# EAGLE schematic CFT-PB0-revF (EAGLE 5.11)
DRAWN_BY: Alexios; PROJECT_NAME: CFT Mini-Computer; REVISION: Rev B; SHEET_DESCRIPTION: Cover Sheet; SIMULATION_FILENAME: register.v#reg_L; URL: http://www.bedroomlan.org/cft

## Sheet 1 of 6
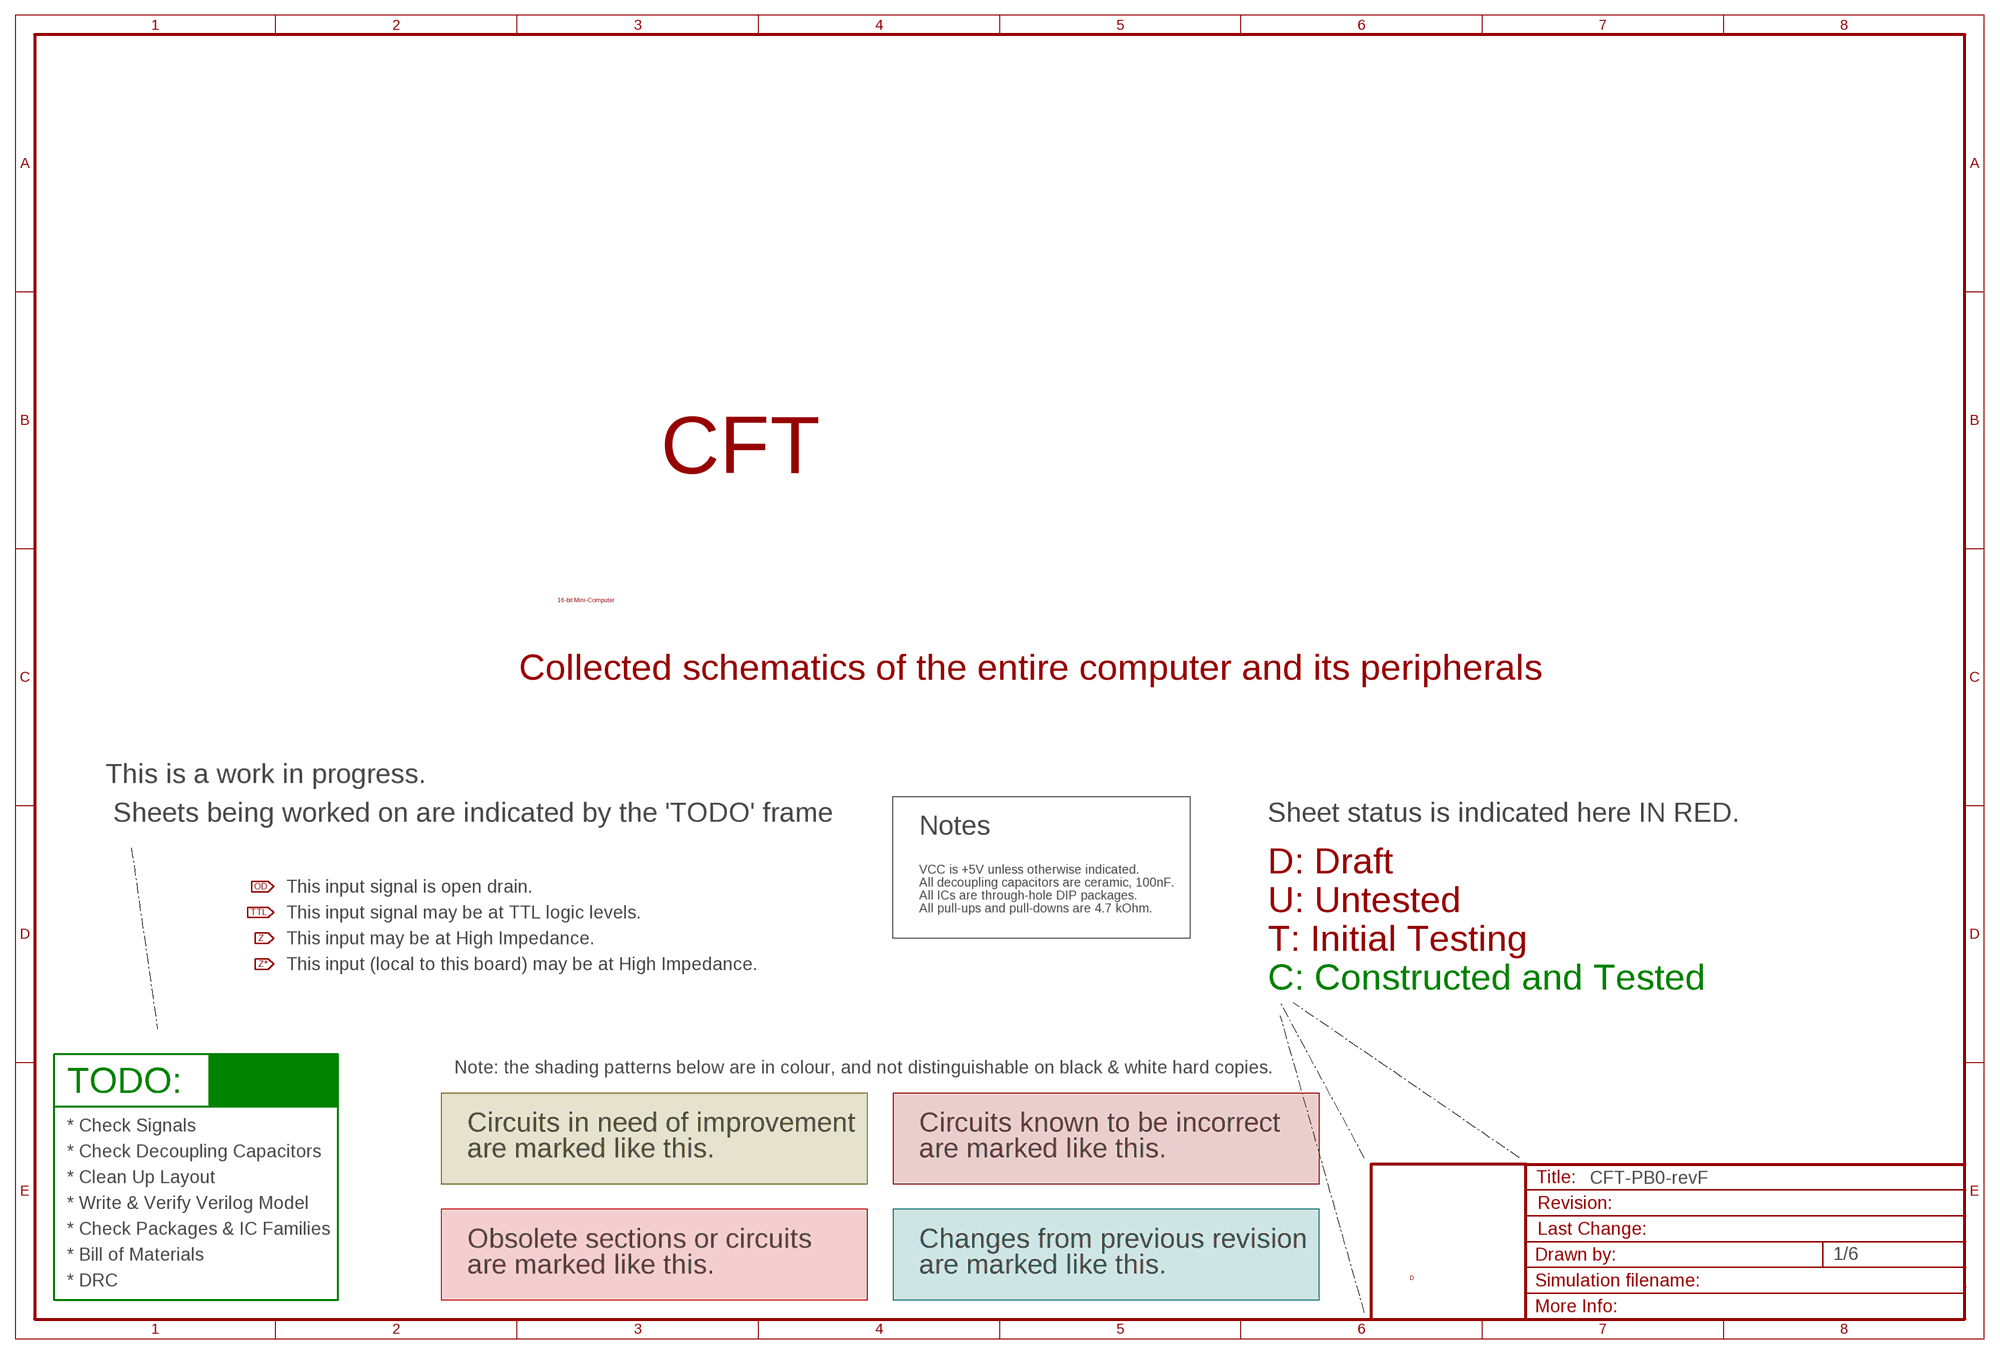
[diagram p0: schematic, sheet 1]

### Notes on the sheet
- CFT
- 16-bit Mini-Computer
- Collected schematics of the entire computer and its peripherals
- This is a work in progress.
- Sheets being worked on are indicated by the 'TODO' frame | Sheet status is indicated here IN RED.
- Notes
- VCC is +5V unless otherwise indicated. | D: Draft
- All decoupling capacitors are ceramic, 100nF.
- This input signal is open drain.
- All ICs are through-hole DIP packages.
- All pull-ups and pull-downs are 4.7 kOhm. | U: Untested
- This input signal may be at TTL logic levels.
- This input may be at High Impedance.
- T: Initial Testing
- This input (local to this board) may be at High Impedance.
- C: Constructed and Tested
- Note: the shading patterns below are in colour, and not distinguishable on black & white hard copies.
- TODO:
- * Check Signals | Circuits in need of improvement | Circuits known to be incorrect
- * Check Decoupling Capacitors | are marked like this. | are marked like this.
- * Clean Up Layout
- * Write & Verify Verilog Model
- * Check Packages & IC Families
- Obsolete sections or circuits | Changes from previous revision
- * Bill of Materials
- are marked like this. | are marked like this.
- D
- * DRC

## Sheet 2 of 6
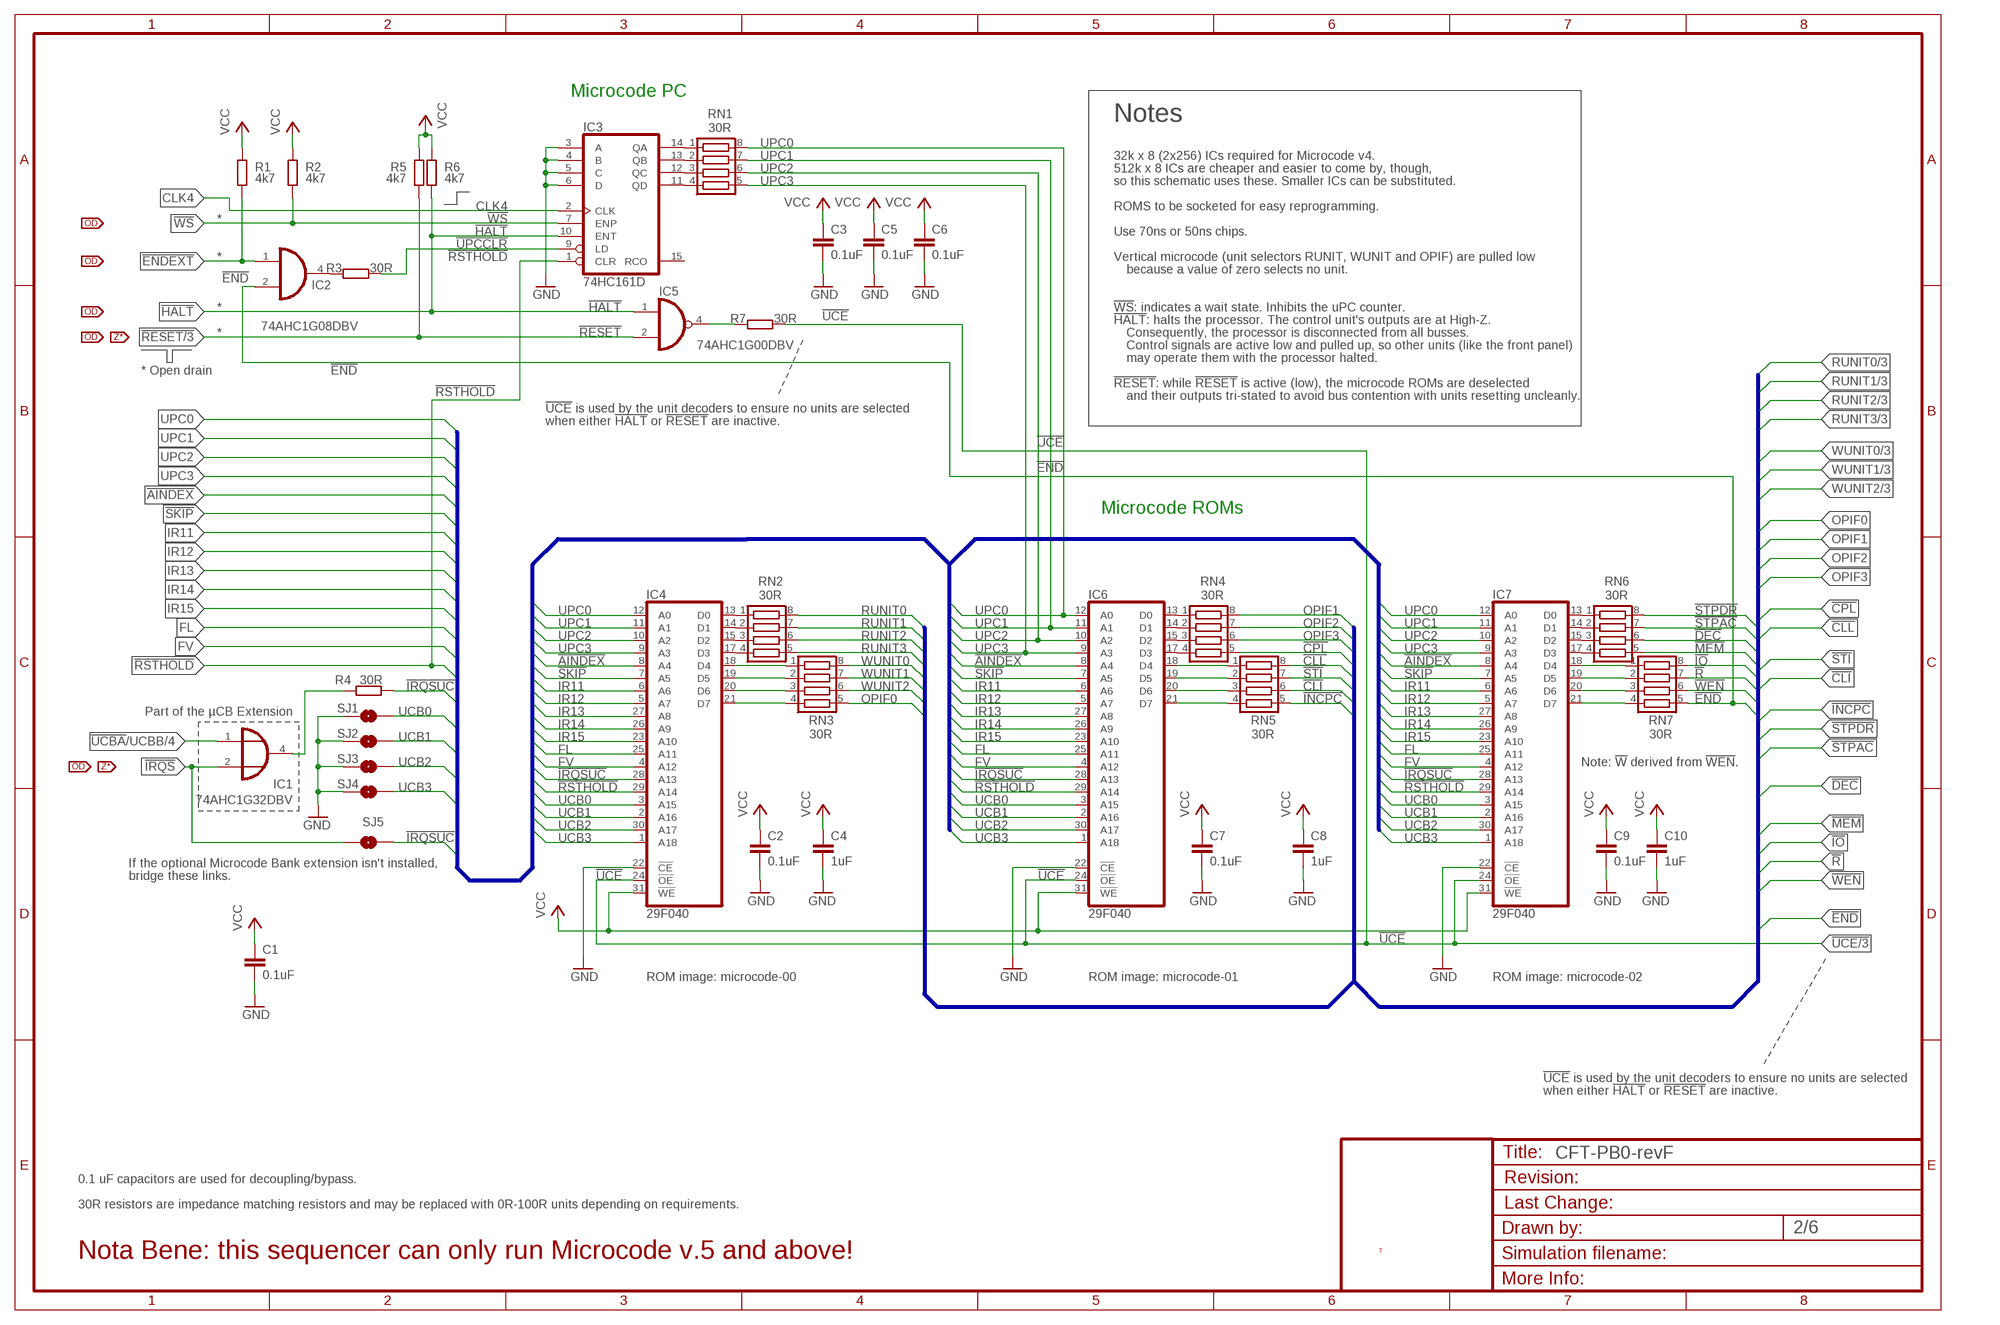
[diagram p1: schematic, sheet 2]

### Parts
C1  0.1uF  C-EUC0805K  [C0805K]
C2  0.1uF  C-EUC0805K  [C0805K]
C3  0.1uF  C-EUC0805K  [C0805K]
C4  1uF  C-EUC0805K  [C0805K]
C5  0.1uF  C-EUC0805K  [C0805K]
C6  0.1uF  C-EUC0805K  [C0805K]
C7  0.1uF  C-EUC0805K  [C0805K]
C8  1uF  C-EUC0805K  [C0805K]
C9  0.1uF  C-EUC0805K  [C0805K]
C10  1uF  C-EUC0805K  [C0805K]
IC1  74AHC1G32DBV  [SOT23-5]
IC2  74AHC1G08DBV  [SOT23-5]
IC3  74HC161D  [SO16D]
IC4  29F040  29F040PLCC32  [PLCC32]
IC5  74AHC1G00DBV  [SOT23-5]
IC6  29F040  29F040PLCC32  [PLCC32]
IC7  29F040  29F040PLCC32  [PLCC32]
R1  4k7  R-EU_R0805  [R0805]
R2  4k7  R-EU_R0805  [R0805]
R3  30R  R-EU_R0805  [R0805]
R4  30R  R-EU_R0805  [R0805]
R5  4k7  R-EU_R0805  [R0805]
R6  4k7  R-EU_R0805  [R0805]
R7  30R  R-EU_R0805  [R0805]
RN1  30R  CTS742C083  [CTS742C083]
RN2  30R  CTS742C083  [CTS742C083]
RN3  30R  CTS742C083  [CTS742C083]
RN4  30R  CTS742C083  [CTS742C083]
RN5  30R  CTS742C083  [CTS742C083]
RN6  30R  CTS742C083  [CTS742C083]
RN7  30R  CTS742C083  [CTS742C083]
SJ1  SOLDERJUMPER-OLDNO  [SJ_2S-NO]
SJ2  SOLDERJUMPER-OLDNO  [SJ_2S-NO]
SJ3  SOLDERJUMPER-OLDNO  [SJ_2S-NO]
SJ4  SOLDERJUMPER-OLDNO  [SJ_2S-NO]
SJ5  SOLDERJUMPER-OLDNO  [SJ_2S-NO]

### Nets
!AINDEX: IC4.8(A4) IC6.8(A4) IC7.8(A4) ; also sheet 5,6
!CLI: RN5.6 ; also sheet 5,6
!CLL: RN5.8 ; also sheet 5,6
!CPL: RN4.5 ; also sheet 5,6
!DEC: RN6.6 ; also sheet 5,6
!END: IC2.2(I1) RN7.5 ; also sheet 4,5,6
!ENDEXT: IC2.1(I0) R1.1 ; also sheet 6
!HALT: IC3.10(ENT) IC5.1(I0) R6.1 ; also sheet 6
!INCPC: RN5.5 ; also sheet 5,6
!IO: RN7.8 ; also sheet 5,6
!IRQS: IC1.2(I1) SJ5.2 ; also sheet 6
!IRQSUC: IC4.28(A13) IC6.28(A13) IC7.28(A13) R4.2 SJ5.1 ; also sheet 5
!MEM: RN6.5 ; also sheet 5,6
!R: RN7.7 ; also sheet 5,6
!RESET: IC5.2(I1) R5.1 ; also sheet 3,4,6
!RSTHOLD: IC3.1(CLR) IC4.29(A14) IC6.29(A14) IC7.29(A14) ; also sheet 5,6
!SKIP: IC4.7(A5) IC6.7(A5) IC7.7(A5) ; also sheet 5,6
!STI: RN5.7 ; also sheet 5,6
!STPAC: RN6.7 ; also sheet 5,6
!STPDR: RN6.8 ; also sheet 5,6
!UCBA!/UCBB: IC1.1(I0) ; also sheet 4
!UCE: IC4.24(!OE) IC6.24(!OE) IC7.24(!OE) R7.2 ; also sheet 3
!UPCCLR: IC3.9(LD) R3.2
!WEN: RN7.6 ; also sheet 5,6
!WS: IC3.7(ENP) R2.1 ; also sheet 6
CLK4: IC3.2(CLK) ; also sheet 5,6
FL: IC4.25(A11) IC6.25(A11) IC7.25(A11) ; also sheet 5,6
FV: IC4.4(A12) IC6.4(A12) IC7.4(A12) ; also sheet 5,6
GND [power rail]: C1.2 C2.2 C3.2 C4.2 C5.2 C6.2 C7.2 C8.2 C9.2 C10.2 IC3.3(A) IC3.4(B) IC3.5(C) IC3.6(D) IC4.22(!CE) IC6.22(!CE) IC7.22(!CE) SJ1.1 SJ2.1 SJ3.1 SJ4.1 ; also sheet 3,4,5,6
IR11: IC4.6(A6) IC6.6(A6) IC7.6(A6) ; also sheet 5,6
IR12: IC4.5(A7) IC6.5(A7) IC7.5(A7) ; also sheet 5,6
IR13: IC4.27(A8) IC6.27(A8) IC7.27(A8) ; also sheet 5,6
IR14: IC4.26(A9) IC6.26(A9) IC7.26(A9) ; also sheet 5,6
IR15: IC4.23(A10) IC6.23(A10) IC7.23(A10) ; also sheet 5,6
N$45: IC5.4(O) R7.1
N$47: IC1.4(O) R4.1
N$54: IC4.14(D1) RN2.2
N$56: IC6.14(D1) RN4.2
N$57: IC6.15(D2) RN4.3
N$58: IC6.17(D3) RN4.4
N$59: IC6.13(D0) RN4.1
N$60: IC6.19(D5) RN5.2
N$61: IC7.14(D1) RN6.2
N$62: IC7.15(D2) RN6.3
N$63: IC7.17(D3) RN6.4
N$64: IC7.13(D0) RN6.1
N$65: IC7.19(D5) RN7.2
N$66: IC7.20(D6) RN7.3
N$67: IC7.21(D7) RN7.4
N$68: IC7.18(D4) RN7.1
N$69: IC6.20(D6) RN5.3
N$70: IC6.21(D7) RN5.4
N$71: IC6.18(D4) RN5.1
N$72: IC3.13(QB) RN1.2
N$73: IC3.12(QC) RN1.3
N$74: IC3.11(QD) RN1.4
N$75: IC3.14(QA) RN1.1
N$90: IC2.4(O) R3.1
N$93: IC4.15(D2) RN2.3
N$94: IC4.17(D3) RN2.4
N$95: IC4.13(D0) RN2.1
N$96: IC4.19(D5) RN3.2
N$97: IC4.20(D6) RN3.3
N$98: IC4.21(D7) RN3.4
N$99: IC4.18(D4) RN3.1
OPIF0: RN3.5 ; also sheet 5,6
OPIF1: RN4.8 ; also sheet 5,6
OPIF2: RN4.7 ; also sheet 5,6
OPIF3: RN4.6 ; also sheet 5,6
RUNIT0: RN2.8 ; also sheet 3,5,6
RUNIT1: RN2.7 ; also sheet 3,5,6
RUNIT2: RN2.6 ; also sheet 3,5,6
RUNIT3: RN2.5 ; also sheet 3,5,6
UCB0: IC4.3(A15) IC6.3(A15) IC7.3(A15) SJ1.2 ; also sheet 4,5
UCB1: IC4.2(A16) IC6.2(A16) IC7.2(A16) SJ2.2 ; also sheet 4,5
UCB2: IC4.30(A17) IC6.30(A17) IC7.30(A17) SJ3.2 ; also sheet 4,5
UCB3: IC4.1(A18) IC6.1(A18) IC7.1(A18) SJ4.2 ; also sheet 4,5
UPC0: IC4.12(A0) IC6.12(A0) IC7.12(A0) RN1.8 ; also sheet 5
UPC1: IC4.11(A1) IC6.11(A1) IC7.11(A1) RN1.7 ; also sheet 5
UPC2: IC4.10(A2) IC6.10(A2) IC7.10(A2) RN1.6 ; also sheet 5
UPC3: IC4.9(A3) IC6.9(A3) IC7.9(A3) RN1.5 ; also sheet 5
VCC [power rail]: C1.1 C2.1 C3.1 C4.1 C5.1 C6.1 C7.1 C8.1 C9.1 C10.1 IC4.31(!WE) IC6.31(!WE) IC7.31(!WE) R1.2 R2.2 R5.2 R6.2 ; also sheet 3,4,5,6
WUNIT0: RN3.8 ; also sheet 3,5
WUNIT1: RN3.7 ; also sheet 3,5
WUNIT2: RN3.6 ; also sheet 3,5
Unconnected: IC3.15(RCO)

### Buses
MCINSTR:RUNIT[0..3],WUNIT[0..2],OPIF[0..3],!CPL,!CLL,!STI,!CLI,!INCPC,!STPDR,!STPAC,!DEC,!MEM,!IO,!R,!WEN,!END
MCADDR:UPC[0..3],!AINDEX,!SKIP,IR[11..15],FL,FV,!IRQSUC,!RSTHOLD,UCB[0..3]

### Notes on the sheet
- Microcode PC
- Notes
- 32k x 8 (2x256) ICs required for Microcode v4.
- 512k x 8 ICs are cheaper and easier to come by, though,
- so this schematic uses these. Smaller ICs can be substituted.
- ROMS to be socketed for easy reprogramming.
- *
- Use 70ns or 50ns chips.
- * | Vertical microcode (unit selectors RUNIT, WUNIT and OPIF) are pulled low
- because a value of zero selects no unit.
- * | !WS!: indicates a wait state. Inhibits the uPC counter.
- !HALT!: halts the processor. The control unit's outputs are at High-Z.
- * | Consequently, the processor is disconnected from all busses.
- Control signals are active low and pulled up, so other units (like the front panel)
- may operate them with the processor halted.
- * Open drain
- !RESET!: while !RESET! is active (low), the microcode ROMs are deselected
- and their outputs tri-stated to avoid bus contention with units resetting uncleanly.
- !UCE! is used by the unit decoders to ensure no units are selected
- when either !HALT! or !RESET! are inactive.
- Microcode ROMs
- Part of the µCB Extension
- Note: !W! derived from !WEN!.
- If the optional Microcode Bank extension isn't installed,
- bridge these links.
- ROM image: microcode-00 | ROM image: microcode-01 | ROM image: microcode-02
- !UCE! is used by the unit decoders to ensure no units are selected
- when either !HALT! or !RESET! are inactive.
- 0.1 uF capacitors are used for decoupling/bypass.
- 30R resistors are impedance matching resistors and may be replaced with 0R-100R units depending on requirements.
- T
- Nota Bene: this sequencer can only run Microcode v.5 and above!

## Sheet 3 of 6
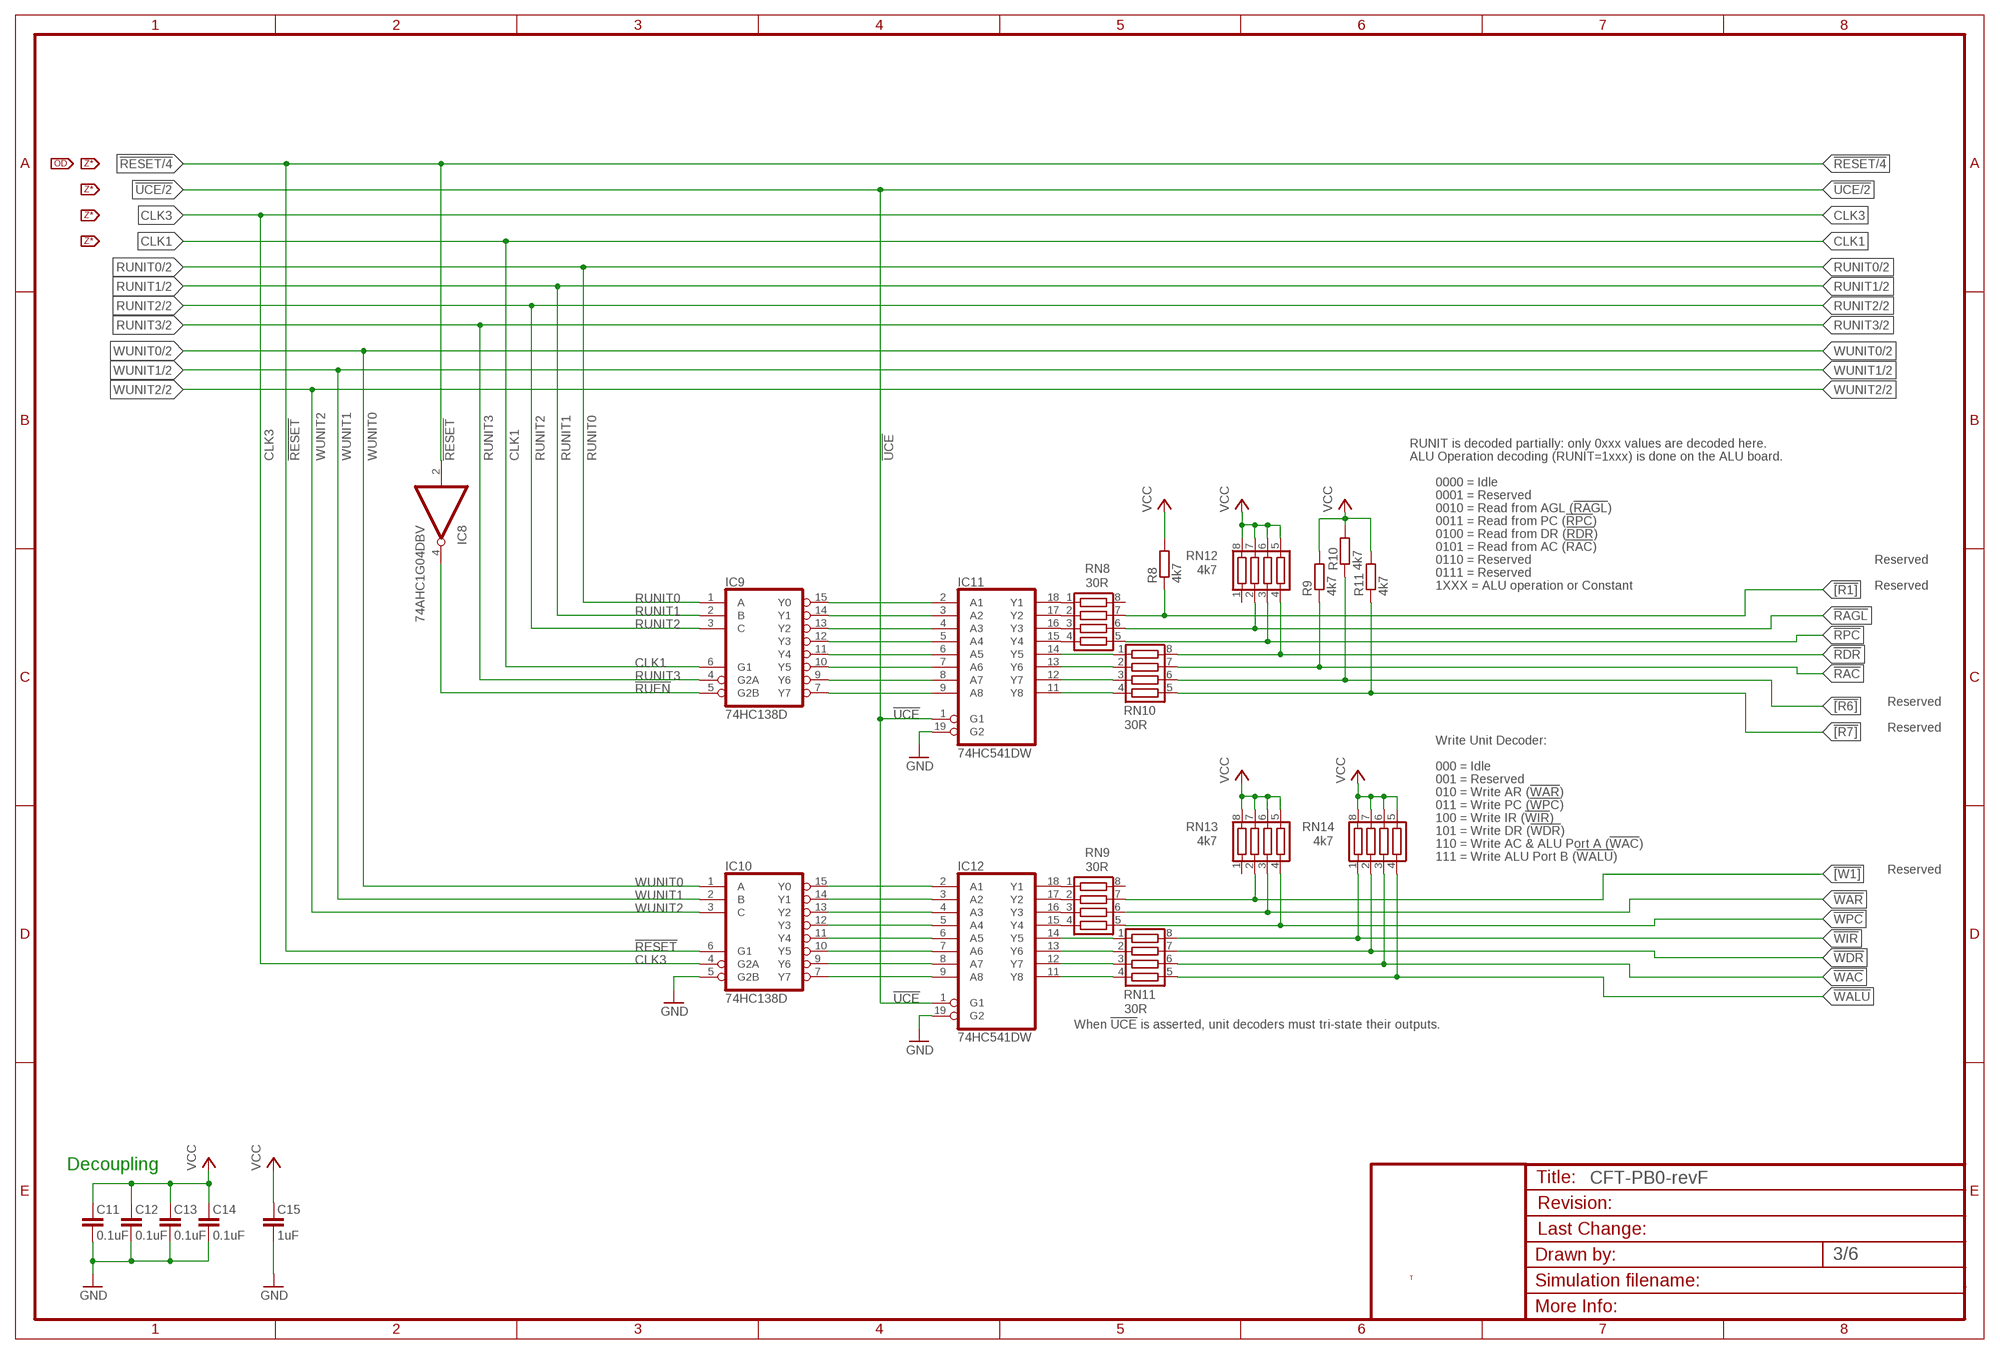
[diagram p2: schematic, sheet 3]

### Parts
C11  0.1uF  C-EUC0805K  [C0805K]
C12  0.1uF  C-EUC0805K  [C0805K]
C13  0.1uF  C-EUC0805K  [C0805K]
C14  0.1uF  C-EUC0805K  [C0805K]
C15  1uF  C-EUC0805K  [C0805K]
IC8  74AHC1G04DBV  [SOT23-5]
IC9  74HC138D  [SO16]
IC10  74HC138D  [SO16]
IC11  74HC541DW  [SO20W]
IC12  74HC541DW  [SO20W]
R8  4k7  R-EU_R0805  [R0805]
R9  4k7  R-EU_R0805  [R0805]
R10  4k7  R-EU_R0805  [R0805]
R11  4k7  R-EU_R0805  [R0805]
RN8  30R  CTS742C083  [CTS742C083]
RN9  30R  CTS742C083  [CTS742C083]
RN10  30R  CTS742C083  [CTS742C083]
RN11  30R  CTS742C083  [CTS742C083]
RN12  4k7  CTS742C083  [CTS742C083]
RN13  4k7  CTS742C083  [CTS742C083]
RN14  4k7  CTS742C083  [CTS742C083]

### Nets
![R1]: R8.1 RN8.7 ; also sheet 6
![R6]: R10.1 RN10.6 ; also sheet 6
![R7]: R11.1 RN10.5 ; also sheet 6
![W1]: RN9.7 RN13.2 ; also sheet 6
!RAC: R9.1 RN10.7 ; also sheet 6
!RAGL: RN8.6 RN12.2 ; also sheet 6
!RDR: RN10.8 RN12.4 ; also sheet 6
!RESET: IC8.2(I) IC10.6(G1) ; also sheet 2,4,6
!RPC: RN8.5 RN12.3 ; also sheet 6
!RUEN: IC8.4(O) IC9.5(G2B)
!UCE: IC11.1(G1) IC12.1(G1) ; also sheet 2
!WAC: RN11.6 RN14.3 ; also sheet 6
!WALU: RN11.5 RN14.4 ; also sheet 6
!WAR: RN9.6 RN13.3 ; also sheet 6
!WDR: RN11.7 RN14.2 ; also sheet 6
!WIR: RN11.8 RN14.1 ; also sheet 6
!WPC: RN9.5 RN13.4 ; also sheet 6
CLK1: IC9.6(G1) ; also sheet 5,6
CLK3: IC10.4(G2A) ; also sheet 5,6
GND [power rail]: C11.1 C12.1 C13.1 C14.1 C15.1 IC10.5(G2B) IC11.19(G2) IC12.19(G2) ; also sheet 2,4,5,6
N$46: IC11.17(Y2) RN8.2
N$49: IC11.16(Y3) RN8.3
N$50: IC11.15(Y4) RN8.4
N$51: IC11.18(Y1) RN8.1
N$52: IC11.13(Y6) RN10.2
N$53: IC11.12(Y7) RN10.3
N$55: IC12.17(Y2) RN9.2
N$76: IC12.16(Y3) RN9.3
N$77: IC12.15(Y4) RN9.4
N$78: IC12.18(Y1) RN9.1
N$79: IC12.13(Y6) RN11.2
N$80: IC12.12(Y7) RN11.3
N$81: IC12.11(Y8) RN11.4
N$82: IC11.11(Y8) RN10.4
N$87: IC11.14(Y5) RN10.1
N$92: IC12.14(Y5) RN11.1
N$458: IC9.7(Y7) IC11.9(A8)
N$459: IC9.9(Y6) IC11.8(A7)
N$460: IC9.10(Y5) IC11.7(A6)
N$461: IC9.11(Y4) IC11.6(A5)
N$463: IC9.12(Y3) IC11.5(A4)
N$464: IC9.13(Y2) IC11.4(A3)
N$465: IC9.14(Y1) IC11.3(A2)
N$466: IC9.15(Y0) IC11.2(A1)
N$483: IC10.15(Y0) IC12.2(A1)
N$484: IC10.14(Y1) IC12.3(A2)
N$485: IC10.13(Y2) IC12.4(A3)
N$486: IC10.12(Y3) IC12.5(A4)
N$487: IC10.11(Y4) IC12.6(A5)
N$488: IC10.10(Y5) IC12.7(A6)
N$505: IC10.9(Y6) IC12.8(A7)
N$506: IC10.7(Y7) IC12.9(A8)
RUNIT0: IC9.1(A) ; also sheet 2,5,6
RUNIT1: IC9.2(B) ; also sheet 2,5,6
RUNIT2: IC9.3(C) ; also sheet 2,5,6
RUNIT3: IC9.4(G2A) ; also sheet 2,5,6
VCC [power rail]: C11.2 C12.2 C13.2 C14.2 C15.2 R8.2 R9.2 R10.2 R11.2 RN12.5 RN12.6 RN12.7 RN12.8 RN13.5 RN13.6 RN13.7 RN13.8 RN14.5 RN14.6 RN14.7 RN14.8 ; also sheet 2,4,5,6
WUNIT0: IC10.1(A) ; also sheet 2,5
WUNIT1: IC10.2(B) ; also sheet 2,5
WUNIT2: IC10.3(C) ; also sheet 2,5
Unconnected: RN8.8 RN9.8 RN12.1 RN13.1

### Notes on the sheet
- RUNIT is decoded partially: only 0xxx values are decoded here.
- ALU Operation decoding (RUNIT=1xxx) is done on the ALU board.
- 0000 = Idle
- 0001 = Reserved
- 0010 = Read from AGL (!RAGL!)
- 0011 = Read from PC (!RPC!)
- 0100 = Read from DR (!RDR!)
- 0101 = Read from AC (!RAC!)
- 0110 = Reserved | Reserved
- 0111 = Reserved
- 1XXX = ALU operation or Constant | Reserved
- Reserved
- Reserved
- Write Unit Decoder:
- 000 = Idle
- 001 = Reserved
- 010 = Write AR (!WAR!)
- 011 = Write PC (!WPC!)
- 100 = Write IR (!WIR!)
- 101 = Write DR (!WDR!)
- 110 = Write AC & ALU Port A (!WAC!)
- 111 = Write ALU Port B (!WALU!)
- Reserved
- When !UCE! is asserted, unit decoders must tri-state their outputs.
- Decoupling
- T

## Sheet 4 of 6
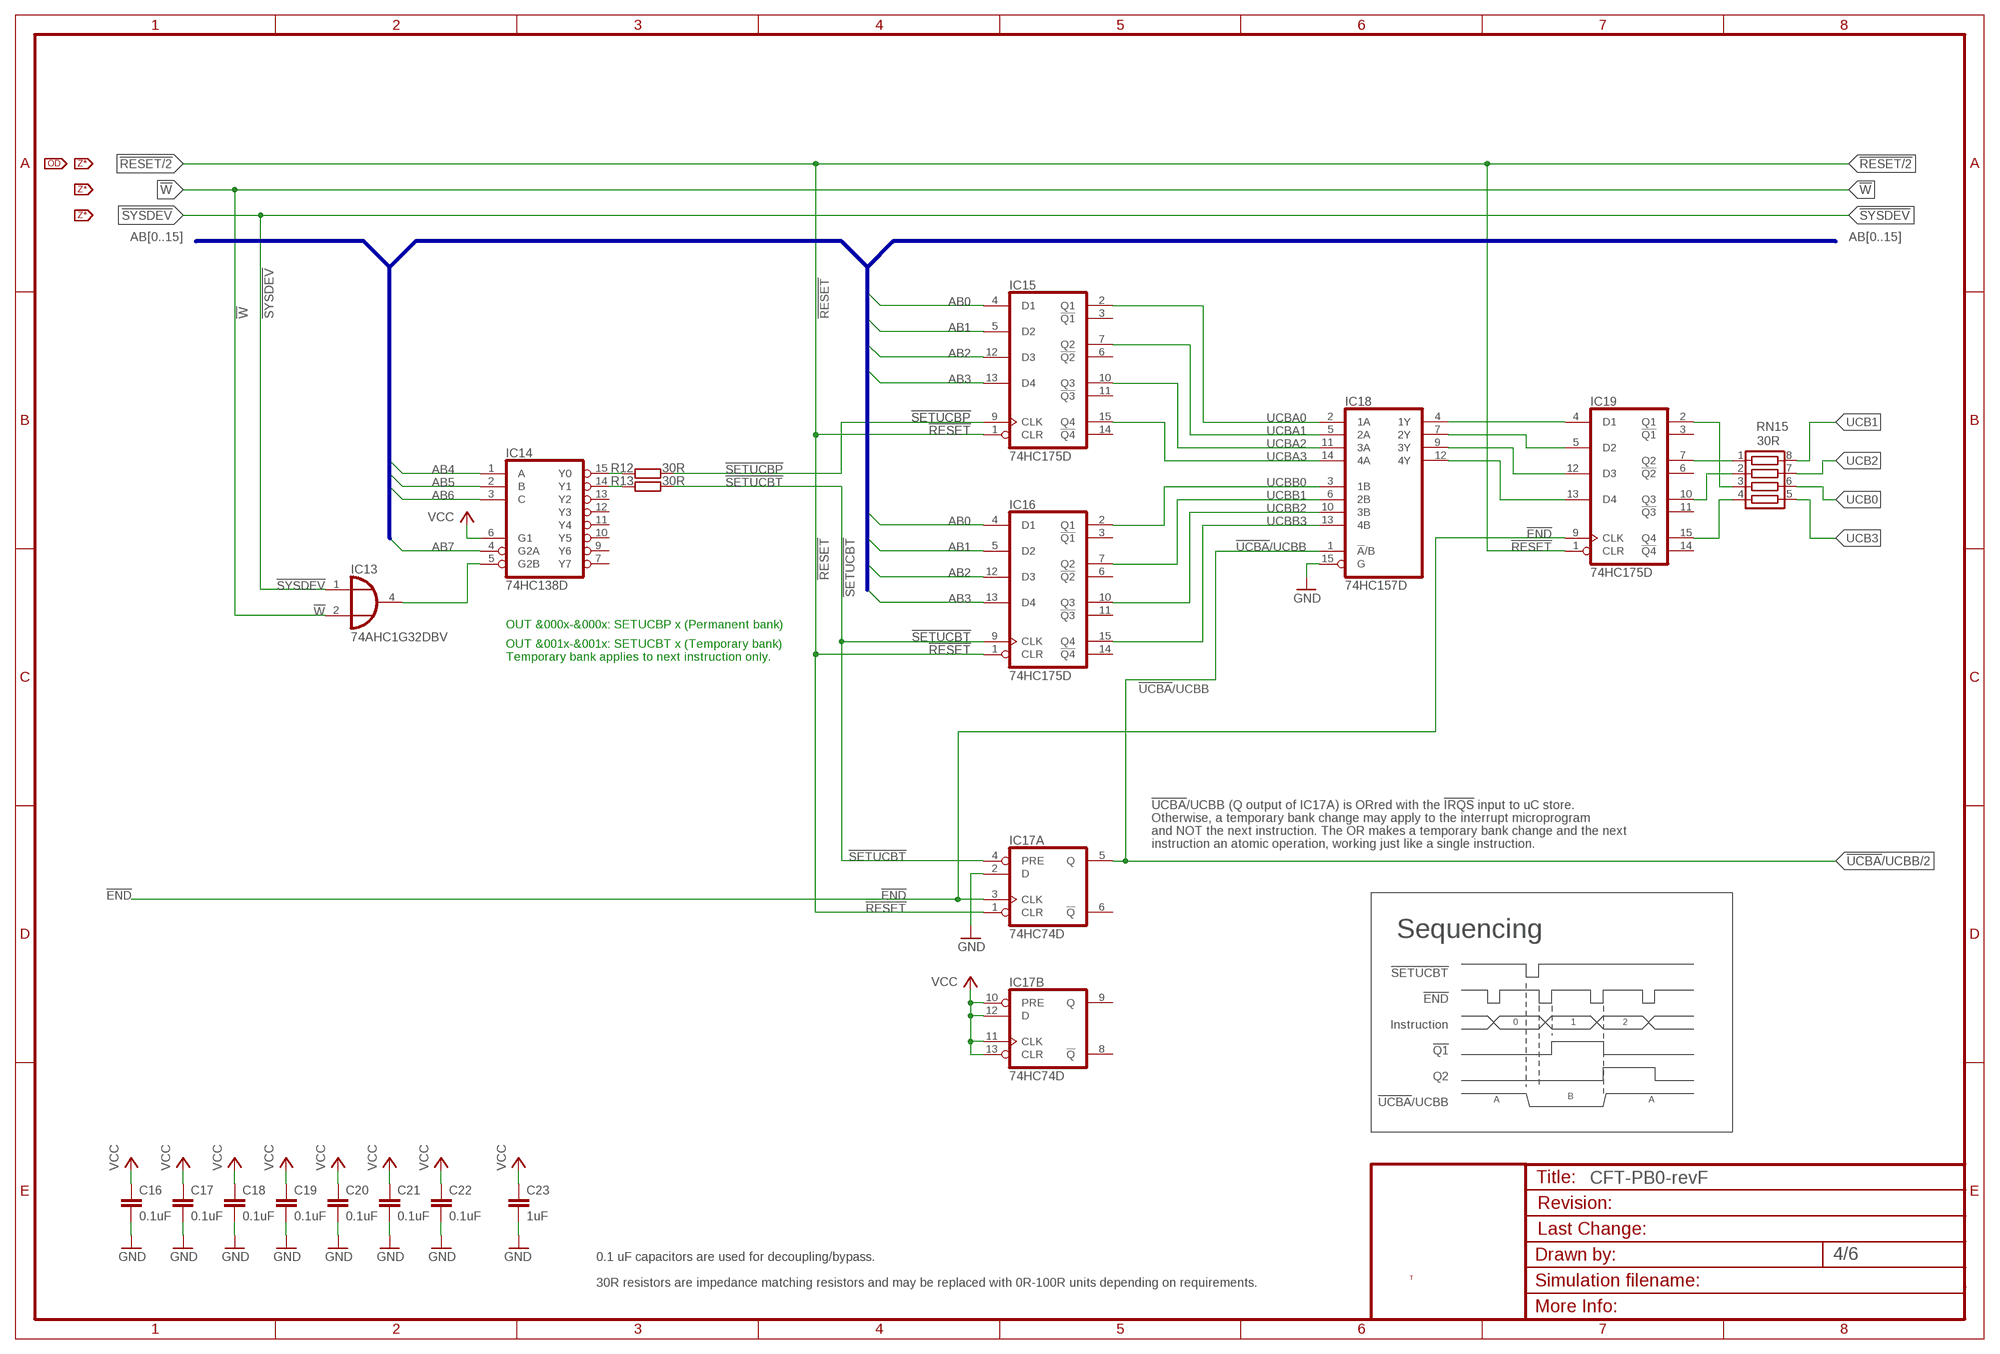
[diagram p3: schematic, sheet 4]

### Parts
C16  0.1uF  C-EUC0805K  [C0805K]
C17  0.1uF  C-EUC0805K  [C0805K]
C18  0.1uF  C-EUC0805K  [C0805K]
C19  0.1uF  C-EUC0805K  [C0805K]
C20  0.1uF  C-EUC0805K  [C0805K]
C21  0.1uF  C-EUC0805K  [C0805K]
C22  0.1uF  C-EUC0805K  [C0805K]
C23  1uF  C-EUC0805K  [C0805K]
IC13  74AHC1G32DBV  [SOT23-5]
IC14  74HC138D  [SO16]
IC15  74HC175D  [SO16]
IC16  74HC175D  [SO16]
IC17  74HC74D  [SO14]
IC18  74HC157D  74HC157/ALT-D  [SO16]
IC19  74HC175D  [SO16]
R12  30R  R-EU_R0805  [R0805]
R13  30R  R-EU_R0805  [R0805]
RN15  30R  CTS742C083  [CTS742C083]

### Nets
!END: IC17.3(A:CLK) IC19.9(CLK) ; also sheet 2,5,6
!RESET: IC15.1(CLR) IC16.1(CLR) IC17.1(A:CLR) IC19.1(CLR) ; also sheet 2,3,6
!SETUCBP: IC15.9(CLK) R12.2
!SETUCBT: IC16.9(CLK) IC17.4(A:PRE) R13.2
!SYSDEV: IC13.1(I0) ; also sheet 5,6
!UCBA!/UCBB: IC17.5(A:Q) IC18.1(!A!/B) ; also sheet 2
!W: IC13.2(I1) ; also sheet 5,6
AB0: IC15.4(D1) IC16.4(D1) ; also sheet 5,6
AB1: IC15.5(D2) IC16.5(D2) ; also sheet 5,6
AB2: IC15.12(D3) IC16.12(D3) ; also sheet 5,6
AB3: IC15.13(D4) IC16.13(D4) ; also sheet 5,6
AB4: IC14.1(A) ; also sheet 5,6
AB5: IC14.2(B) ; also sheet 5,6
AB6: IC14.3(C) ; also sheet 5,6
AB7: IC14.4(G2A) ; also sheet 5,6
GND [power rail]: C16.2 C17.2 C18.2 C19.2 C20.2 C21.2 C22.2 C23.2 IC17.2(A:D) IC18.15(G) ; also sheet 2,3,5,6
N$1: IC13.4(O) IC14.5(G2B)
N$2: IC18.4(1Y) IC19.4(D1)
N$3: IC18.7(2Y) IC19.5(D2)
N$4: IC18.9(3Y) IC19.12(D3)
N$5: IC18.12(4Y) IC19.13(D4)
N$48: IC19.10(Q3) RN15.2
N$83: IC14.15(Y0) R12.1
N$84: IC14.14(Y1) R13.1
N$88: IC19.2(Q1) RN15.3
N$89: IC19.7(Q2) RN15.1
N$91: IC19.15(Q4) RN15.4
UCB0: RN15.6 ; also sheet 2,5
UCB1: RN15.8 ; also sheet 2,5
UCB2: RN15.7 ; also sheet 2,5
UCB3: RN15.5 ; also sheet 2,5
UCBA0: IC15.2(Q1) IC18.2(1A)
UCBA1: IC15.7(Q2) IC18.5(2A)
UCBA2: IC15.10(Q3) IC18.11(3A)
UCBA3: IC15.15(Q4) IC18.14(4A)
UCBB0: IC16.2(Q1) IC18.3(1B)
UCBB1: IC16.7(Q2) IC18.6(2B)
UCBB2: IC16.10(Q3) IC18.10(3B)
UCBB3: IC16.15(Q4) IC18.13(4B)
VCC [power rail]: C16.1 C17.1 C18.1 C19.1 C20.1 C21.1 C22.1 C23.1 IC14.6(G1) IC17.10(B:PRE) IC17.11(B:CLK) IC17.12(B:D) IC17.13(B:CLR) ; also sheet 2,3,5,6
Unconnected: IC14.7(Y7) IC14.9(Y6) IC14.10(Y5) IC14.11(Y4) IC14.12(Y3) IC14.13(Y2) IC15.3(!Q1) IC15.6(!Q2) IC15.11(!Q3) IC15.14(!Q4) IC16.3(!Q1) IC16.6(!Q2) IC16.11(!Q3) IC16.14(!Q4) IC17.6(A:!Q) IC17.8(B:!Q) IC17.9(B:Q) IC19.3(!Q1) IC19.6(!Q2) IC19.11(!Q3) IC19.14(!Q4)

### Buses
AB[0..15]

### Notes on the sheet
- OUT &000x-&000x: SETUCBP x (Permanent bank)
- OUT &001x-&001x: SETUCBT x (Temporary bank)
- Temporary bank applies to next instruction only.
- !UCBA!/UCBB (Q output of IC17A) is ORred with the !IRQS! input to uC store.
- Otherwise, a temporary bank change may apply to the interrupt microprogram
- and NOT the next instruction. The OR makes a temporary bank change and the next
- instruction an atomic operation, working just like a single instruction.
- Sequencing
- !SETUCBT
- !END
- 0 | 1 | 2
- Instruction
- !Q1
- Q2
- B
- A | A
- !UCBA!/UCBB
- 0.1 uF capacitors are used for decoupling/bypass.
- T
- 30R resistors are impedance matching resistors and may be replaced with 0R-100R units depending on requirements.

## Sheet 5 of 6
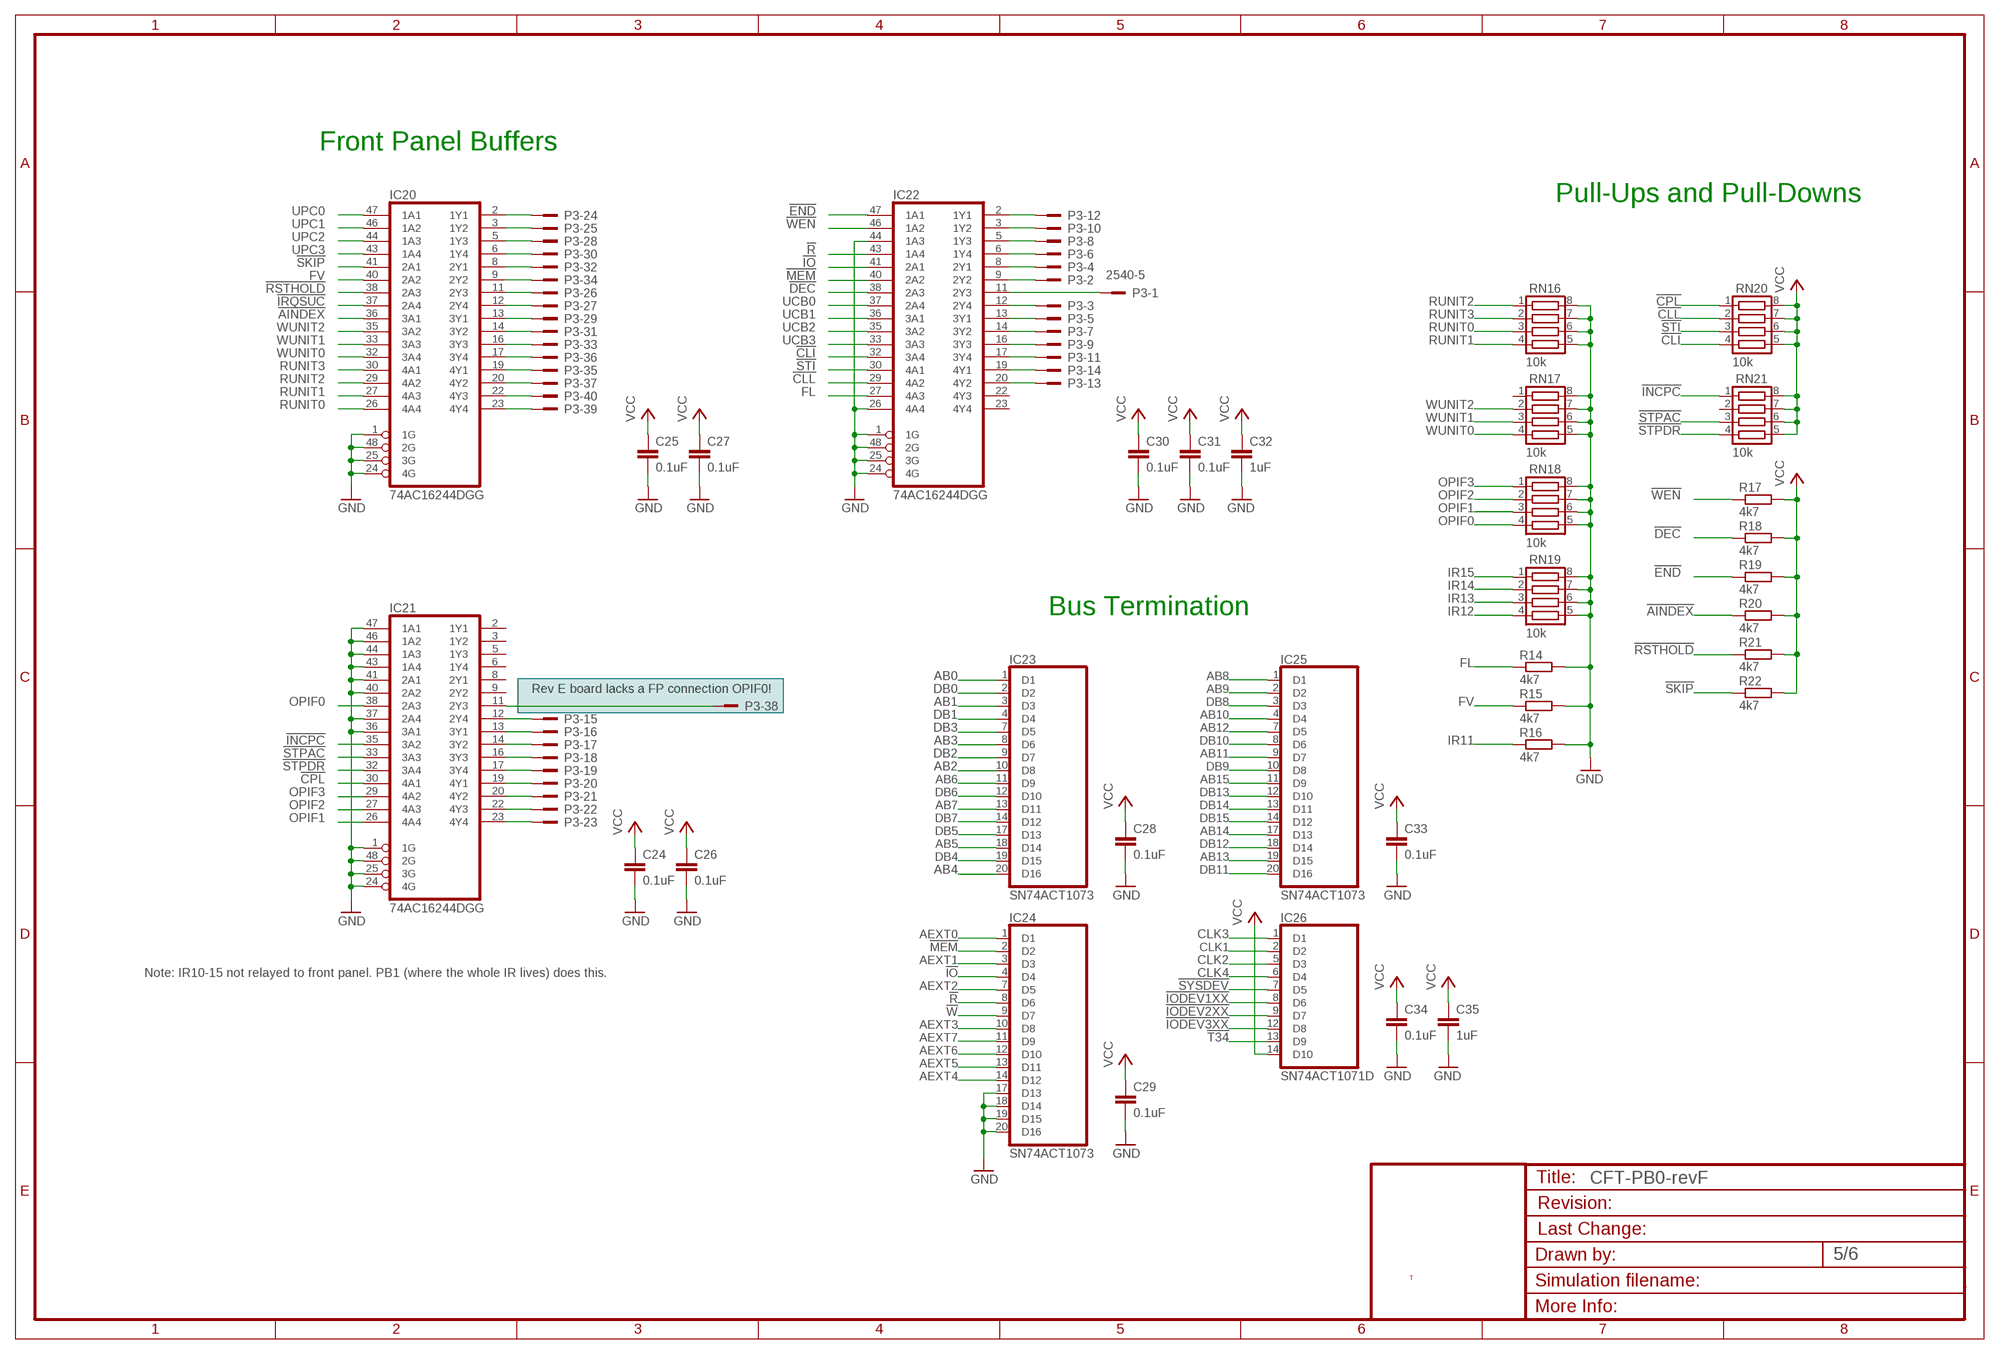
[diagram p4: schematic, sheet 5]

### Parts
C24  0.1uF  C-EUC0805K  [C0805K]
C25  0.1uF  C-EUC0805K  [C0805K]
C26  0.1uF  C-EUC0805K  [C0805K]
C27  0.1uF  C-EUC0805K  [C0805K]
C28  0.1uF  C-EUC0805K  [C0805K]
C29  0.1uF  C-EUC0805K  [C0805K]
C30  0.1uF  C-EUC0805K  [C0805K]
C31  0.1uF  C-EUC0805K  [C0805K]
C32  1uF  C-EUC0805K  [C0805K]
C33  0.1uF  C-EUC0805K  [C0805K]
C34  0.1uF  C-EUC0805K  [C0805K]
C35  1uF  C-EUC0805K  [C0805K]
IC20  74AC16244DGG  [TSSOP-48]
IC21  74AC16244DGG  [TSSOP-48]
IC22  74AC16244DGG  [TSSOP-48]
IC23  SN74ACT1073  [SO20W]
IC24  SN74ACT1073  [SO20W]
IC25  SN74ACT1073  [SO20W]
IC26  SN74ACT1071D  [SO14]
P3  2540-5  [PAK100/2500-5-40]
R14  4k7  R-EU_R0805  [R0805]
R15  4k7  R-EU_R0805  [R0805]
R16  4k7  R-EU_R0805  [R0805]
R17  4k7  R-EU_R0805  [R0805]
R18  4k7  R-EU_R0805  [R0805]
R19  4k7  R-EU_R0805  [R0805]
R20  4k7  R-EU_R0805  [R0805]
R21  4k7  R-EU_R0805  [R0805]
R22  4k7  R-EU_R0805  [R0805]
RN16  10k  CTS742C083  [CTS742C083]
RN17  10k  CTS742C083  [CTS742C083]
RN18  10k  CTS742C083  [CTS742C083]
RN19  10k  CTS742C083  [CTS742C083]
RN20  10k  CTS742C083  [CTS742C083]
RN21  10k  CTS742C083  [CTS742C083]

### Nets
!AINDEX: IC20.36(3A1) R20.1 ; also sheet 2,6
!CLI: IC22.32(3A4) RN20.4 ; also sheet 2,6
!CLL: IC22.29(4A2) RN20.2 ; also sheet 2,6
!CPL: IC21.30(4A1) RN20.1 ; also sheet 2,6
!DEC: IC22.38(2A3) R18.1 ; also sheet 2,6
!END: IC22.47(1A1) R19.1 ; also sheet 2,4,6
!INCPC: IC21.35(3A2) RN21.1 ; also sheet 2,6
!IO: IC22.41(2A1) IC24.4(D4) ; also sheet 2,6
!IODEV1XX: IC26.8(D6) ; also sheet 6
!IODEV2XX: IC26.9(D7) ; also sheet 6
!IODEV3XX: IC26.12(D8) ; also sheet 6
!IRQSUC: IC20.37(2A4) ; also sheet 2
!MEM: IC22.40(2A2) IC24.2(D2) ; also sheet 2,6
!R: IC22.43(1A4) IC24.8(D6) ; also sheet 2,6
!RSTHOLD: IC20.38(2A3) R21.1 ; also sheet 2,6
!SKIP: IC20.41(2A1) R22.1 ; also sheet 2,6
!STI: IC22.30(4A1) RN20.3 ; also sheet 2,6
!STPAC: IC21.33(3A3) RN21.3 ; also sheet 2,6
!STPDR: IC21.32(3A4) RN21.4 ; also sheet 2,6
!SYSDEV: IC26.7(D5) ; also sheet 4,6
!T34: IC26.13(D9) ; also sheet 6
!W: IC24.9(D7) ; also sheet 4,6
!WEN: IC22.46(1A2) R17.1 ; also sheet 2,6
AB0: IC23.1(D1) ; also sheet 4,6
AB1: IC23.3(D3) ; also sheet 4,6
AB2: IC23.10(D8) ; also sheet 4,6
AB3: IC23.8(D6) ; also sheet 4,6
AB4: IC23.20(D16) ; also sheet 4,6
AB5: IC23.18(D14) ; also sheet 4,6
AB6: IC23.11(D9) ; also sheet 4,6
AB7: IC23.13(D11) ; also sheet 4,6
AB8: IC25.1(D1) ; also sheet 6
AB9: IC25.2(D2) ; also sheet 6
AB10: IC25.4(D4) ; also sheet 6
AB11: IC25.9(D7) ; also sheet 6
AB12: IC25.7(D5) ; also sheet 6
AB13: IC25.19(D15) ; also sheet 6
AB14: IC25.17(D13) ; also sheet 6
AB15: IC25.11(D9) ; also sheet 6
AEXT0: IC24.1(D1) ; also sheet 6
AEXT1: IC24.3(D3) ; also sheet 6
AEXT2: IC24.7(D5) ; also sheet 6
AEXT3: IC24.10(D8) ; also sheet 6
AEXT4: IC24.14(D12) ; also sheet 6
AEXT5: IC24.13(D11) ; also sheet 6
AEXT6: IC24.12(D10) ; also sheet 6
AEXT7: IC24.11(D9) ; also sheet 6
CLK1: IC26.2(D2) ; also sheet 3,6
CLK2: IC26.5(D3) ; also sheet 6
CLK3: IC26.1(D1) ; also sheet 3,6
CLK4: IC26.6(D4) ; also sheet 2,6
DB0: IC23.2(D2) ; also sheet 6
DB1: IC23.4(D4) ; also sheet 6
DB2: IC23.9(D7) ; also sheet 6
DB3: IC23.7(D5) ; also sheet 6
DB4: IC23.19(D15) ; also sheet 6
DB5: IC23.17(D13) ; also sheet 6
DB6: IC23.12(D10) ; also sheet 6
DB7: IC23.14(D12) ; also sheet 6
DB8: IC25.3(D3) ; also sheet 6
DB9: IC25.10(D8) ; also sheet 6
DB10: IC25.8(D6) ; also sheet 6
DB11: IC25.20(D16) ; also sheet 6
DB12: IC25.18(D14) ; also sheet 6
DB13: IC25.12(D10) ; also sheet 6
DB14: IC25.13(D11) ; also sheet 6
DB15: IC25.14(D12) ; also sheet 6
FL: IC22.27(4A3) R14.1 ; also sheet 2,6
FV: IC20.40(2A2) R15.1 ; also sheet 2,6
GND [power rail]: C24.2 C25.2 C26.2 C27.2 C28.2 C29.2 C30.2 C31.2 C32.2 C33.2 C34.2 C35.2 IC20.1(1G) IC20.24(4G) IC20.25(3G) IC20.48(2G) IC21.1(1G) IC21.24(4G) IC21.25(3G) IC21.36(3A1) IC21.37(2A4) IC21.40(2A2) IC21.41(2A1) IC21.43(1A4) IC21.44(1A3) IC21.46(1A2) IC21.47(1A1) IC21.48(2G) IC22.1(1G) IC22.24(4G) IC22.25(3G) IC22.26(4A4) IC22.44(1A3) IC22.48(2G) IC24.17(D13) IC24.18(D14) IC24.19(D15) IC24.20(D16) R14.2 R15.2 R16.2 RN16.5 RN16.6 RN16.7 RN16.8 RN17.5 RN17.6 RN17.7 RN17.8 RN18.5 RN18.6 RN18.7 RN18.8 RN19.5 RN19.6 RN19.7 RN19.8 ; also sheet 2,3,4,6
IR11: R16.1 ; also sheet 2,6
IR12: RN19.4 ; also sheet 2,6
IR13: RN19.3 ; also sheet 2,6
IR14: RN19.2 ; also sheet 2,6
IR15: RN19.1 ; also sheet 2,6
N$6: IC20.22(4Y3) P3.40
N$7: IC20.20(4Y2) P3.37
N$8: IC20.23(4Y4) P3.39
N$9: IC20.19(4Y1) P3.35
N$10: IC22.2(1Y1) P3.12
N$11: IC22.3(1Y2) P3.10
N$12: IC22.9(2Y2) P3.2
N$13: IC22.8(2Y1) P3.4
N$14: IC22.6(1Y4) P3.6
N$15: IC22.5(1Y3) P3.8
N$16: IC22.11(2Y3) P3.1
N$17: IC22.12(2Y4) P3.3
N$18: IC22.13(3Y1) P3.5
N$19: IC22.14(3Y2) P3.7
N$20: IC22.16(3Y3) P3.9
N$21: IC22.17(3Y4) P3.11
N$22: IC22.20(4Y2) P3.13
N$23: IC22.19(4Y1) P3.14
N$24: IC20.17(3Y4) P3.36
N$25: IC20.16(3Y3) P3.33
N$26: IC20.14(3Y2) P3.31
N$27: IC20.13(3Y1) P3.29
N$28: IC20.12(2Y4) P3.27
N$29: IC20.11(2Y3) P3.26
N$30: IC20.9(2Y2) P3.34
N$31: IC20.8(2Y1) P3.32
N$32: IC20.6(1Y4) P3.30
N$33: IC20.5(1Y3) P3.28
N$34: IC20.3(1Y2) P3.25
N$35: IC20.2(1Y1) P3.24
N$36: IC21.23(4Y4) P3.23
N$37: IC21.22(4Y3) P3.22
N$38: IC21.20(4Y2) P3.21
N$39: IC21.19(4Y1) P3.20
N$40: IC21.17(3Y4) P3.19
N$41: IC21.16(3Y3) P3.18
N$42: IC21.14(3Y2) P3.17
N$43: IC21.13(3Y1) P3.16
N$44: IC21.12(2Y4) P3.15
N$85: IC21.11(2Y3) P3.38
OPIF0: IC21.38(2A3) RN18.4 ; also sheet 2,6
OPIF1: IC21.26(4A4) RN18.3 ; also sheet 2,6
OPIF2: IC21.27(4A3) RN18.2 ; also sheet 2,6
OPIF3: IC21.29(4A2) RN18.1 ; also sheet 2,6
RUNIT0: IC20.26(4A4) RN16.3 ; also sheet 2,3,6
RUNIT1: IC20.27(4A3) RN16.4 ; also sheet 2,3,6
RUNIT2: IC20.29(4A2) RN16.1 ; also sheet 2,3,6
RUNIT3: IC20.30(4A1) RN16.2 ; also sheet 2,3,6
UCB0: IC22.37(2A4) ; also sheet 2,4
UCB1: IC22.36(3A1) ; also sheet 2,4
UCB2: IC22.35(3A2) ; also sheet 2,4
UCB3: IC22.33(3A3) ; also sheet 2,4
UPC0: IC20.47(1A1) ; also sheet 2
UPC1: IC20.46(1A2) ; also sheet 2
UPC2: IC20.44(1A3) ; also sheet 2
UPC3: IC20.43(1A4) ; also sheet 2
VCC [power rail]: C24.1 C25.1 C26.1 C27.1 C28.1 C29.1 C30.1 C31.1 C32.1 C33.1 C34.1 C35.1 IC26.14(D10) R17.2 R18.2 R19.2 R20.2 R21.2 R22.2 RN20.5 RN20.6 RN20.7 RN20.8 RN21.5 RN21.6 RN21.7 RN21.8 ; also sheet 2,3,4,6
WUNIT0: IC20.32(3A4) RN17.4 ; also sheet 2,3
WUNIT1: IC20.33(3A3) RN17.3 ; also sheet 2,3
WUNIT2: IC20.35(3A2) RN17.2 ; also sheet 2,3
Unconnected: IC21.2(1Y1) IC21.3(1Y2) IC21.5(1Y3) IC21.6(1Y4) IC21.8(2Y1) IC21.9(2Y2) IC22.22(4Y3) IC22.23(4Y4) RN17.1 RN21.2

### Notes on the sheet
- Front Panel Buffers
- Pull-Ups and Pull-Downs
- Bus Termination
- Rev E board lacks a FP connection OPIF0!
- Note: IR10-15 not relayed to front panel. PB1 (where the whole IR lives) does this.
- T

## Sheet 6 of 6
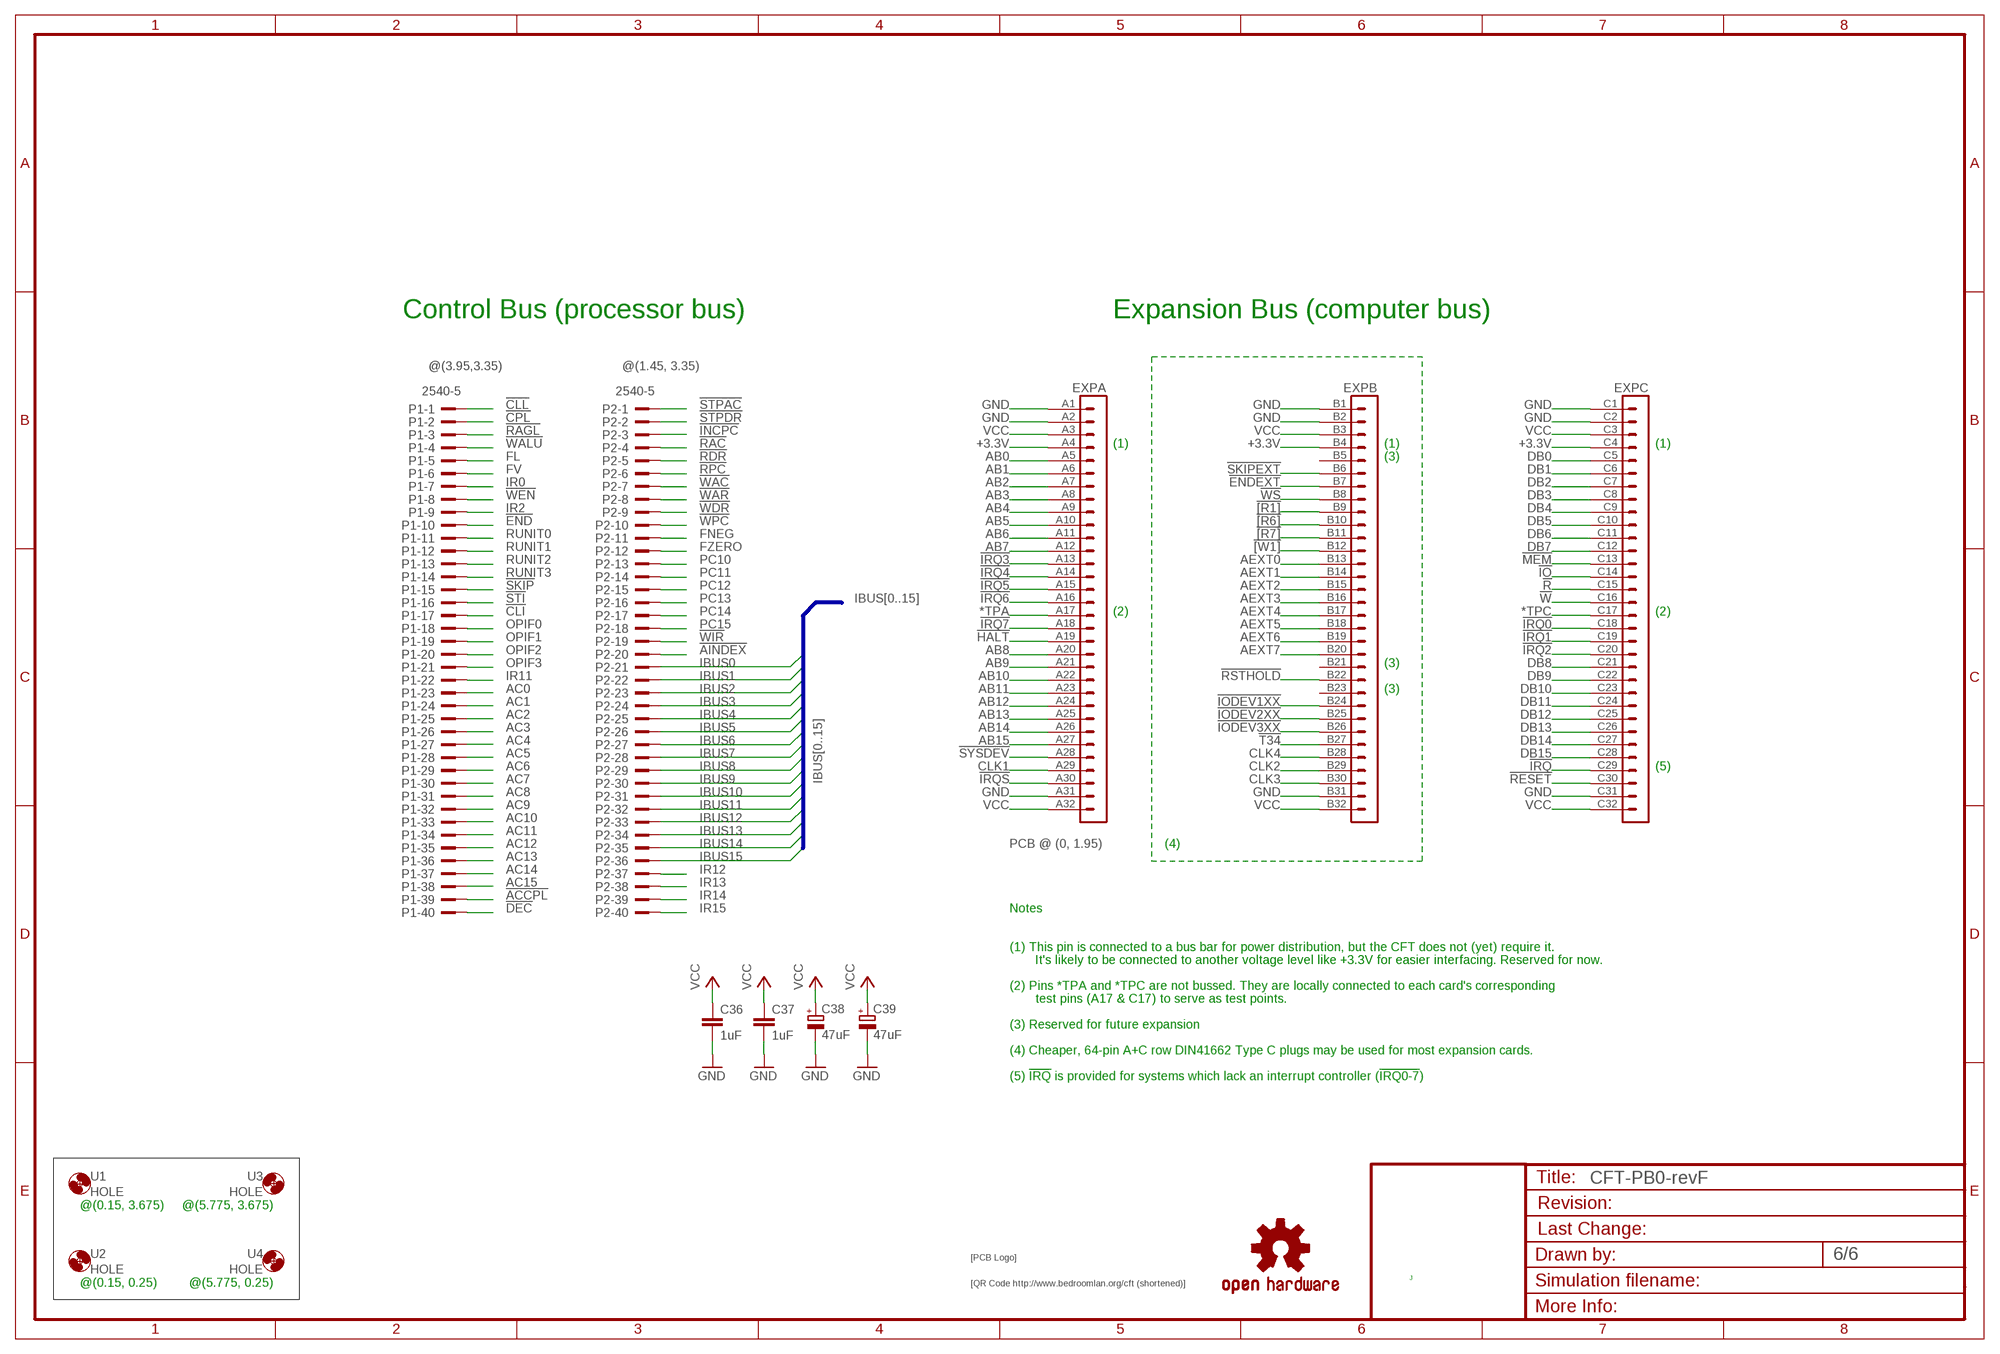
[diagram p5: schematic, sheet 6]

### Parts
$4_37_$  SIGNATURESILK  [SIGNATURE]
$4_39_$  OSHW-LOGOL  [OSHW-LOGO-L]
$4_40_$  QRCODE-CFT  [CFT-QRCODE]
C36  1uF  C-EUC0805K  [C0805K]
C37  1uF  C-EUC0805K  [C0805K]
C38  47uF  CPOL-EUE2.5-5  [E2,5-5]
C39  47uF  CPOL-EUE2.5-5  [E2,5-5]
EXP  VG96-3K  [VG96K]
P1  2540-5  [PAK100/2500-5-40]
P2  2540-5  [PAK100/2500-5-40]
U1  HOLE  [STANDOFF_28_60]
U2  HOLE  [STANDOFF_28_60]
U3  HOLE  [STANDOFF_28_60]
U4  HOLE  [STANDOFF_28_60]

### Nets
![R1]: EXP.B9 ; also sheet 3
![R6]: EXP.B10 ; also sheet 3
![R7]: EXP.B11 ; also sheet 3
![W1]: EXP.B12 ; also sheet 3
!ACCPL: P1.39
!AINDEX: P2.20 ; also sheet 2,5
!CLI: P1.17 ; also sheet 2,5
!CLL: P1.1 ; also sheet 2,5
!CPL: P1.2 ; also sheet 2,5
!DEC: P1.40 ; also sheet 2,5
!END: P1.10 ; also sheet 2,4,5
!ENDEXT: EXP.B7 ; also sheet 2
!HALT: EXP.A19 ; also sheet 2
!INCPC: P2.3 ; also sheet 2,5
!IO: EXP.C14 ; also sheet 2,5
!IODEV1XX: EXP.B24 ; also sheet 5
!IODEV2XX: EXP.B25 ; also sheet 5
!IODEV3XX: EXP.B26 ; also sheet 5
!IRQ: EXP.C29
!IRQ0: EXP.C18
!IRQ1: EXP.C19
!IRQ2: EXP.C20
!IRQ3: EXP.A13
!IRQ4: EXP.A14
!IRQ5: EXP.A15
!IRQ6: EXP.A16
!IRQ7: EXP.A18
!IRQS: EXP.A30 ; also sheet 2
!MEM: EXP.C13 ; also sheet 2,5
!R: EXP.C15 ; also sheet 2,5
!RAC: P2.4 ; also sheet 3
!RAGL: P1.3 ; also sheet 3
!RDR: P2.5 ; also sheet 3
!RESET: EXP.C30 ; also sheet 2,3,4
!RPC: P2.6 ; also sheet 3
!RSTHOLD: EXP.B22 ; also sheet 2,5
!SKIP: P1.15 ; also sheet 2,5
!SKIPEXT: EXP.B6
!STI: P1.16 ; also sheet 2,5
!STPAC: P2.1 ; also sheet 2,5
!STPDR: P2.2 ; also sheet 2,5
!SYSDEV: EXP.A28 ; also sheet 4,5
!T34: EXP.B27 ; also sheet 5
!W: EXP.C16 ; also sheet 4,5
!WAC: P2.7 ; also sheet 3
!WALU: P1.4 ; also sheet 3
!WAR: P2.8 ; also sheet 3
!WDR: P2.9 ; also sheet 3
!WEN: P1.8 ; also sheet 2,5
!WIR: P2.19 ; also sheet 3
!WPC: P2.10 ; also sheet 3
!WS: EXP.B8 ; also sheet 2
*TPA: EXP.A17
*TPC: EXP.C17
+3.3V [power rail]: EXP.A4 EXP.B4 EXP.C4
AB0: EXP.A5 ; also sheet 4,5
AB1: EXP.A6 ; also sheet 4,5
AB2: EXP.A7 ; also sheet 4,5
AB3: EXP.A8 ; also sheet 4,5
AB4: EXP.A9 ; also sheet 4,5
AB5: EXP.A10 ; also sheet 4,5
AB6: EXP.A11 ; also sheet 4,5
AB7: EXP.A12 ; also sheet 4,5
AB8: EXP.A20 ; also sheet 5
AB9: EXP.A21 ; also sheet 5
AB10: EXP.A22 ; also sheet 5
AB11: EXP.A23 ; also sheet 5
AB12: EXP.A24 ; also sheet 5
AB13: EXP.A25 ; also sheet 5
AB14: EXP.A26 ; also sheet 5
AB15: EXP.A27 ; also sheet 5
AC0: P1.23
AC1: P1.24
AC2: P1.25
AC3: P1.26
AC4: P1.27
AC5: P1.28
AC6: P1.29
AC7: P1.30
AC8: P1.31
AC9: P1.32
AC10: P1.33
AC11: P1.34
AC12: P1.35
AC13: P1.36
AC14: P1.37
AC15: P1.38
AEXT0: EXP.B13 ; also sheet 5
AEXT1: EXP.B14 ; also sheet 5
AEXT2: EXP.B15 ; also sheet 5
AEXT3: EXP.B16 ; also sheet 5
AEXT4: EXP.B17 ; also sheet 5
AEXT5: EXP.B18 ; also sheet 5
AEXT6: EXP.B19 ; also sheet 5
AEXT7: EXP.B20 ; also sheet 5
CLK1: EXP.A29 ; also sheet 3,5
CLK2: EXP.B29 ; also sheet 5
CLK3: EXP.B30 ; also sheet 3,5
CLK4: EXP.B28 ; also sheet 2,5
DB0: EXP.C5 ; also sheet 5
DB1: EXP.C6 ; also sheet 5
DB2: EXP.C7 ; also sheet 5
DB3: EXP.C8 ; also sheet 5
DB4: EXP.C9 ; also sheet 5
DB5: EXP.C10 ; also sheet 5
DB6: EXP.C11 ; also sheet 5
DB7: EXP.C12 ; also sheet 5
DB8: EXP.C21 ; also sheet 5
DB9: EXP.C22 ; also sheet 5
DB10: EXP.C23 ; also sheet 5
DB11: EXP.C24 ; also sheet 5
DB12: EXP.C25 ; also sheet 5
DB13: EXP.C26 ; also sheet 5
DB14: EXP.C27 ; also sheet 5
DB15: EXP.C28 ; also sheet 5
FL: P1.5 ; also sheet 2,5
FNEG: P2.11
FV: P1.6 ; also sheet 2,5
FZERO: P2.12
GND [power rail]: C36.2 C37.2 C38.- C39.- EXP.A1 EXP.A2 EXP.A31 EXP.B1 EXP.B2 EXP.B31 EXP.C1 EXP.C2 EXP.C31 ; also sheet 2,3,4,5
IBUS0: P2.21
IBUS1: P2.22
IBUS2: P2.23
IBUS3: P2.24
IBUS4: P2.25
IBUS5: P2.26
IBUS6: P2.27
IBUS7: P2.28
IBUS8: P2.29
IBUS9: P2.30
IBUS10: P2.31
IBUS11: P2.32
IBUS12: P2.33
IBUS13: P2.34
IBUS14: P2.35
IBUS15: P2.36
IR0: P1.7
IR2: P1.9
IR11: P1.22 ; also sheet 2,5
IR12: P2.37 ; also sheet 2,5
IR13: P2.38 ; also sheet 2,5
IR14: P2.39 ; also sheet 2,5
IR15: P2.40 ; also sheet 2,5
OPIF0: P1.18 ; also sheet 2,5
OPIF1: P1.19 ; also sheet 2,5
OPIF2: P1.20 ; also sheet 2,5
OPIF3: P1.21 ; also sheet 2,5
PC10: P2.13
PC11: P2.14
PC12: P2.15
PC13: P2.16
PC14: P2.17
PC15: P2.18
RUNIT0: P1.11 ; also sheet 2,3,5
RUNIT1: P1.12 ; also sheet 2,3,5
RUNIT2: P1.13 ; also sheet 2,3,5
RUNIT3: P1.14 ; also sheet 2,3,5
VCC [power rail]: C36.1 C37.1 C38.+ C39.+ EXP.A3 EXP.A32 EXP.B3 EXP.B32 EXP.C3 EXP.C32 ; also sheet 2,3,4,5
Unconnected: EXP.B5 EXP.B21 EXP.B23

### Buses
IBUS[0..15]

### Notes on the sheet
- Control Bus (processor bus) | Expansion Bus (computer bus)
- @(3.95,3.35) | @(1.45, 3.35)
- (1) | (1) | (1)
- (3)
- (2) | (2)
- (3)
- (3)
- (5)
- PCB @ (0, 1.95) | (4)
- Notes
- (1) This pin is connected to a bus bar for power distribution, but the CFT does not (yet) require it.
- It's likely to be connected to another voltage level like +3.3V for easier interfacing. Reserved for now.
- (2) Pins *TPA and *TPC are not bussed. They are locally connected to each card's corresponding
- test pins (A17 & C17) to serve as test points.
- (3) Reserved for future expansion
- (4) Cheaper, 64-pin A+C row DIN41662 Type C plugs may be used for most expansion cards.
- (5) !IRQ! is provided for systems which lack an interrupt controller (!IRQ0-7!)
- @(0.15, 3.675) | @(5.775, 3.675)
- J
- @(0.15, 0.25) | @(5.775, 0.25)

## Power pins joined to a net without a drawn wire
GND: IC1.3(GND) IC2.3(GND) IC3.8(GND) IC4.16(GND) IC5.3(GND) IC6.16(GND) IC7.16(GND) IC8.3(GND) IC9.8(GND) IC10.8(GND) IC11.10(GND) IC12.10(GND) IC13.3(GND) IC14.8(GND) IC15.8(GND) IC16.8(GND) IC17.7(P:GND) IC18.8(GND) IC19.8(GND) IC20.4(GND) IC20.10(GND) IC20.15(GND) IC20.21(GND) IC20.28(GND) IC20.34(GND) IC20.39(GND) IC20.45(GND) IC21.4(GND) IC21.10(GND) IC21.15(GND) IC21.21(GND) IC21.28(GND) IC21.34(GND) IC21.39(GND) IC21.45(GND) IC22.4(GND) IC22.10(GND) IC22.15(GND) IC22.21(GND) IC22.28(GND) IC22.34(GND) IC22.39(GND) IC22.45(GND) IC23.5(GND) IC23.6(GND) IC24.5(GND) IC24.6(GND) IC25.5(GND) IC25.6(GND) IC26.3(GND) IC26.4(GND)
VCC: IC1.5(VCC) IC2.5(VCC) IC3.16(VCC) IC4.32(VCC) IC5.5(VCC) IC6.32(VCC) IC7.32(VCC) IC8.5(VCC) IC9.16(VCC) IC10.16(VCC) IC11.20(VCC) IC12.20(VCC) IC13.5(VCC) IC14.16(VCC) IC15.16(VCC) IC16.16(VCC) IC17.14(P:VCC) IC18.16(VCC) IC19.16(VCC) IC20.7(VCC) IC20.18(VCC) IC20.31(VCC) IC20.42(VCC) IC21.7(VCC) IC21.18(VCC) IC21.31(VCC) IC21.42(VCC) IC22.7(VCC) IC22.18(VCC) IC22.31(VCC) IC22.42(VCC) IC23.15(VCC) IC23.16(VCC) IC24.15(VCC) IC24.16(VCC) IC25.15(VCC) IC25.16(VCC) IC26.10(VCC) IC26.11(VCC)

## Library data of the parts
$4_37_$ = alexios:SIGNATURE: Soup signature
$4_39_$ = SparkFun:OSHW-LOGO: Open Source Hardware Logo This logo indicates the piece of hardware it is found on incorporates a OSHW license and/or adheres to the definition of open source hardware found here: http://freedomdefined.org/OSHW
$4_40_$ = alexios:QRCODE-*: Various QR codes in silkscreen.
C1-C37 = rcl:C-EU: CAPACITOR, European symbol
C38 C39 = rcl:CPOL-EU: POLARIZED CAPACITOR, European symbol
EXP = alexios-19inch:VG96-3: PCB EUROCARD, 96-pin type C/ABC, 2.54 mm
IC1 IC13 = alexios:74*1G32: 2-input OR gate
IC2 = alexios:74*1G08: 2-input AND gate
IC3 = alexios:74*161: 4-Bit Synchronous Binary Counter. 4-bit synchronous binary counter with asynchronous reset. The ?AC163 devices are 4-bit binary counters. These synchronous, presettable counters feature an internal carry look-ahead for application in high-speed counting designs. Synchronous operation is provided by having all flip-flops clocked simultaneously so that the outputs change, coincident with each other, when instructed by the count-enable (ENP, ENT) inputs and internal gating.
IC4 IC6 IC7 = alexios:29F040: 4-mbit (512x8) Flash memory in a PLCC32 package (with socket). AM29F040 is an example of this.
IC5 = alexios:74*1G00: 2-input NAND gate
IC8 = alexios:74*1G04: INVERTER Gate
IC9 IC10 IC14 = alexios:74*138: 3-line to 8-line DECODER/DEMULTIPLEXER
IC11 IC12 = alexios:74*541: Octal BUFFER and LINE DRIVER, 3-state
IC15 IC16 IC19 = alexios:74*175: Qadruple D type FLIP FLOP, clear
IC17 = alexios:74*74: Dual D type positive edge triggered FLIP FLOP, preset and clear
IC18 = alexios:74*157/ALT-: Quadruple 2-line to 1-line data SELECTOR/MULTIPLEXER
IC20-IC22 = alexios:74*16244: 16-bit BUFFER/LINE DRIVER, 3-state Datasheet <http://www.ti.com/lit/ds/scds168/scds168.pdf>
IC23-IC25 = alexios:SN74ACT1073: SN74ACT1073 16-Bit Bus-Termination Array with Bus-Hold Function Datasheet <http://www.ti.com/lit/ds/symlink/sn74act1073.pdf>
IC26 = alexios:SN74ACT1071: 10-BIT BUS-TERMINATION ARRAY WITH BUS-HOLD FUNCTION Datasheet: http://www.ti.com/lit/ds/scas192/scas192.pdf
P1-P3 = con-3m:2540-: 3M (TM) Pak 100 4-Wall Header Source: 3M; OC_FARNELL: 9838414; OC_NEWARK: unknown
R1 R2 R5 R6 R8-R11 R14-R22 = resistor:R-EU_: RESISTOR, European symbol
R3 R4 R7 R12 R13 = rcl:R-EU_: RESISTOR, European symbol
RN1-RN21 = resistor-net:CTS742C083: Chip Resistor Array 4 Single Resistor Source: http://www.ctscorp.com/components/Datasheets/CTSChipArrayDs.pdf; OC_FARNELL: unknown; OC_NEWARK: unknown
SJ1-SJ5 = SparkFun:SOLDERJUMPER-OLD: Solder Jumper Standard SMD solder jumper. Used to automate production. Two varients : Normally Open and Normally Closed are the same, but have different paste layers. NC will have a large amount of paste and should jumper during reflow.
U1-U4 = alexios:HOLE: Hole for a standoff or mount. Hole diameter: 3.3mm. External Diameter: 6mm. Suitable for M3 standoffs.

## Net classes
0 default: width 0.203 mm, clearance 0.152 mm
1 low power: width 0.203 mm, clearance 0.152 mm
2 power rail: width 0.61 mm, clearance 0.203 mm